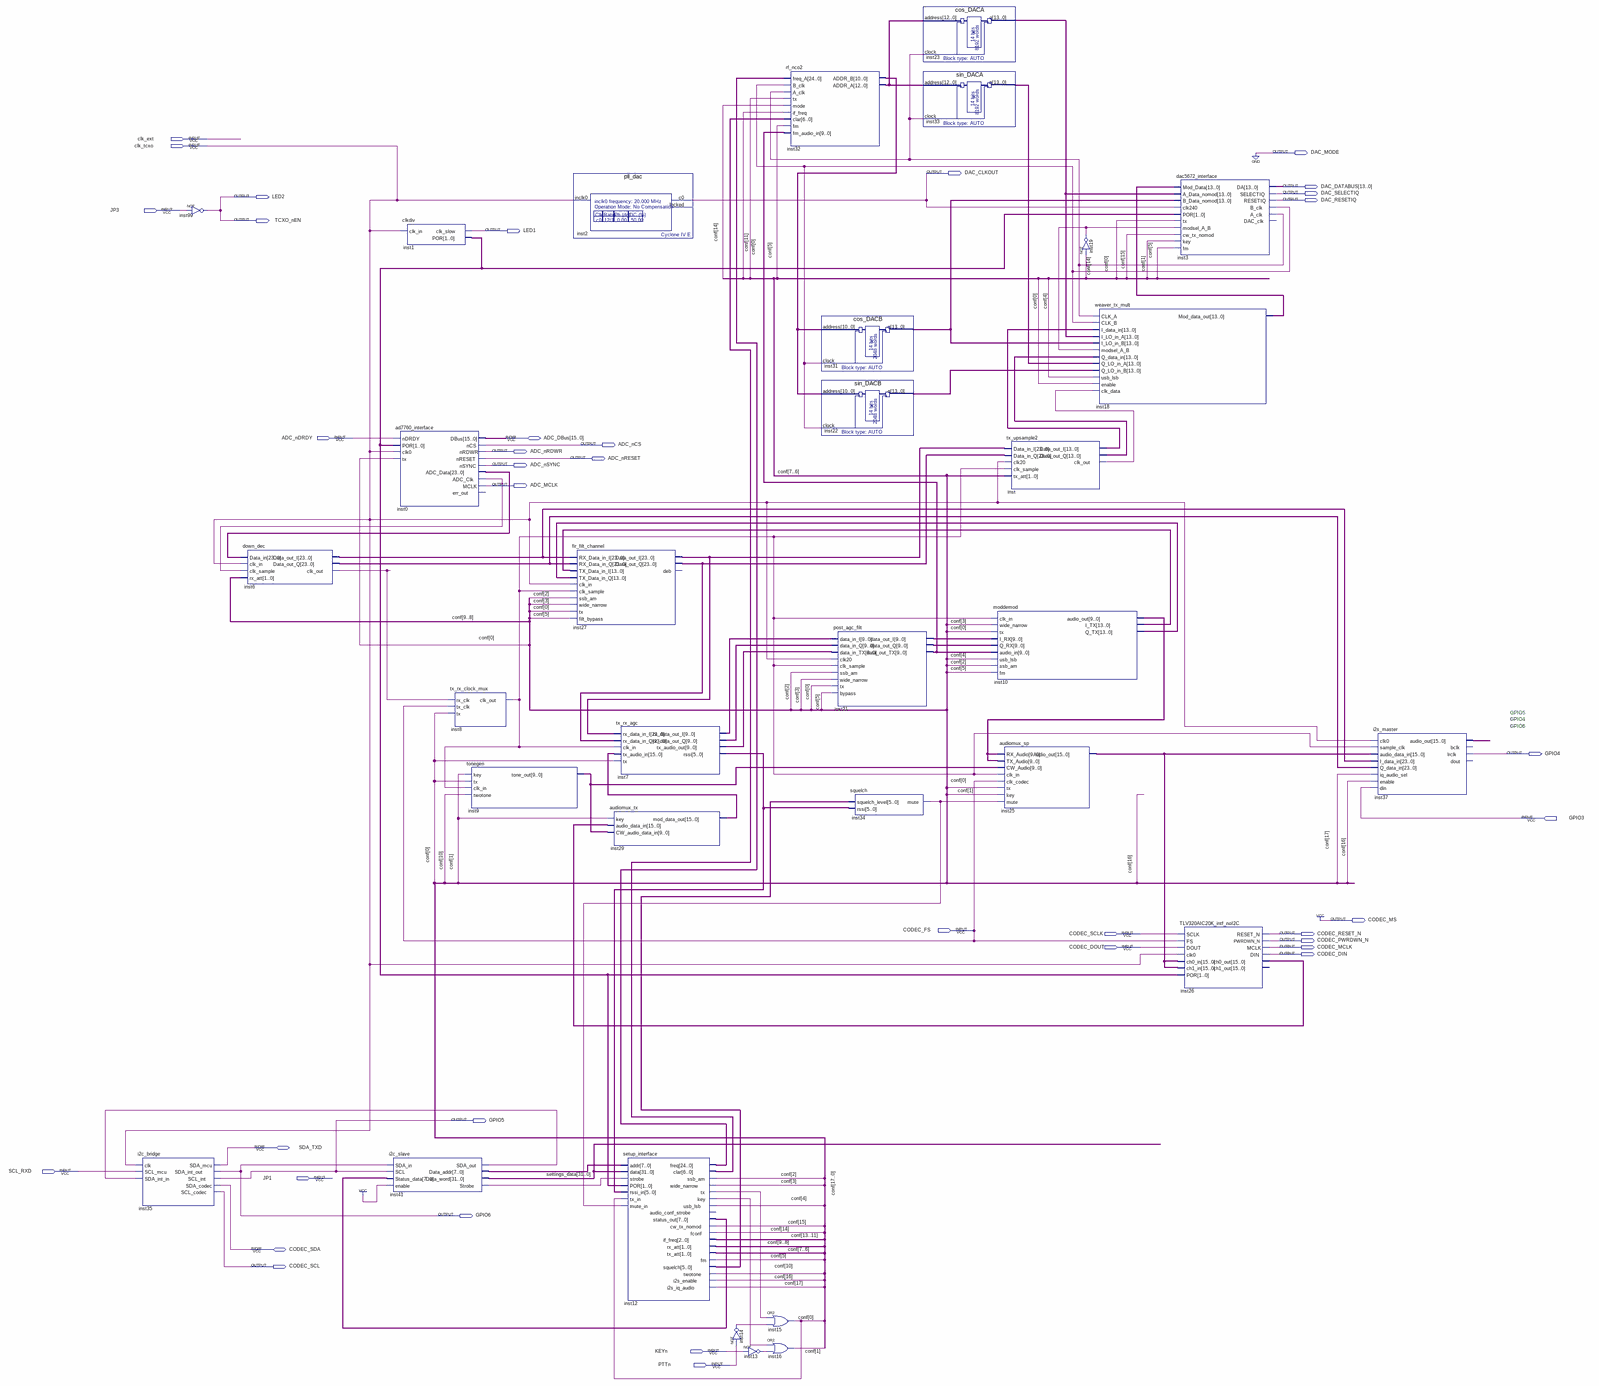
[diagram p0: schematic sheet, whole]
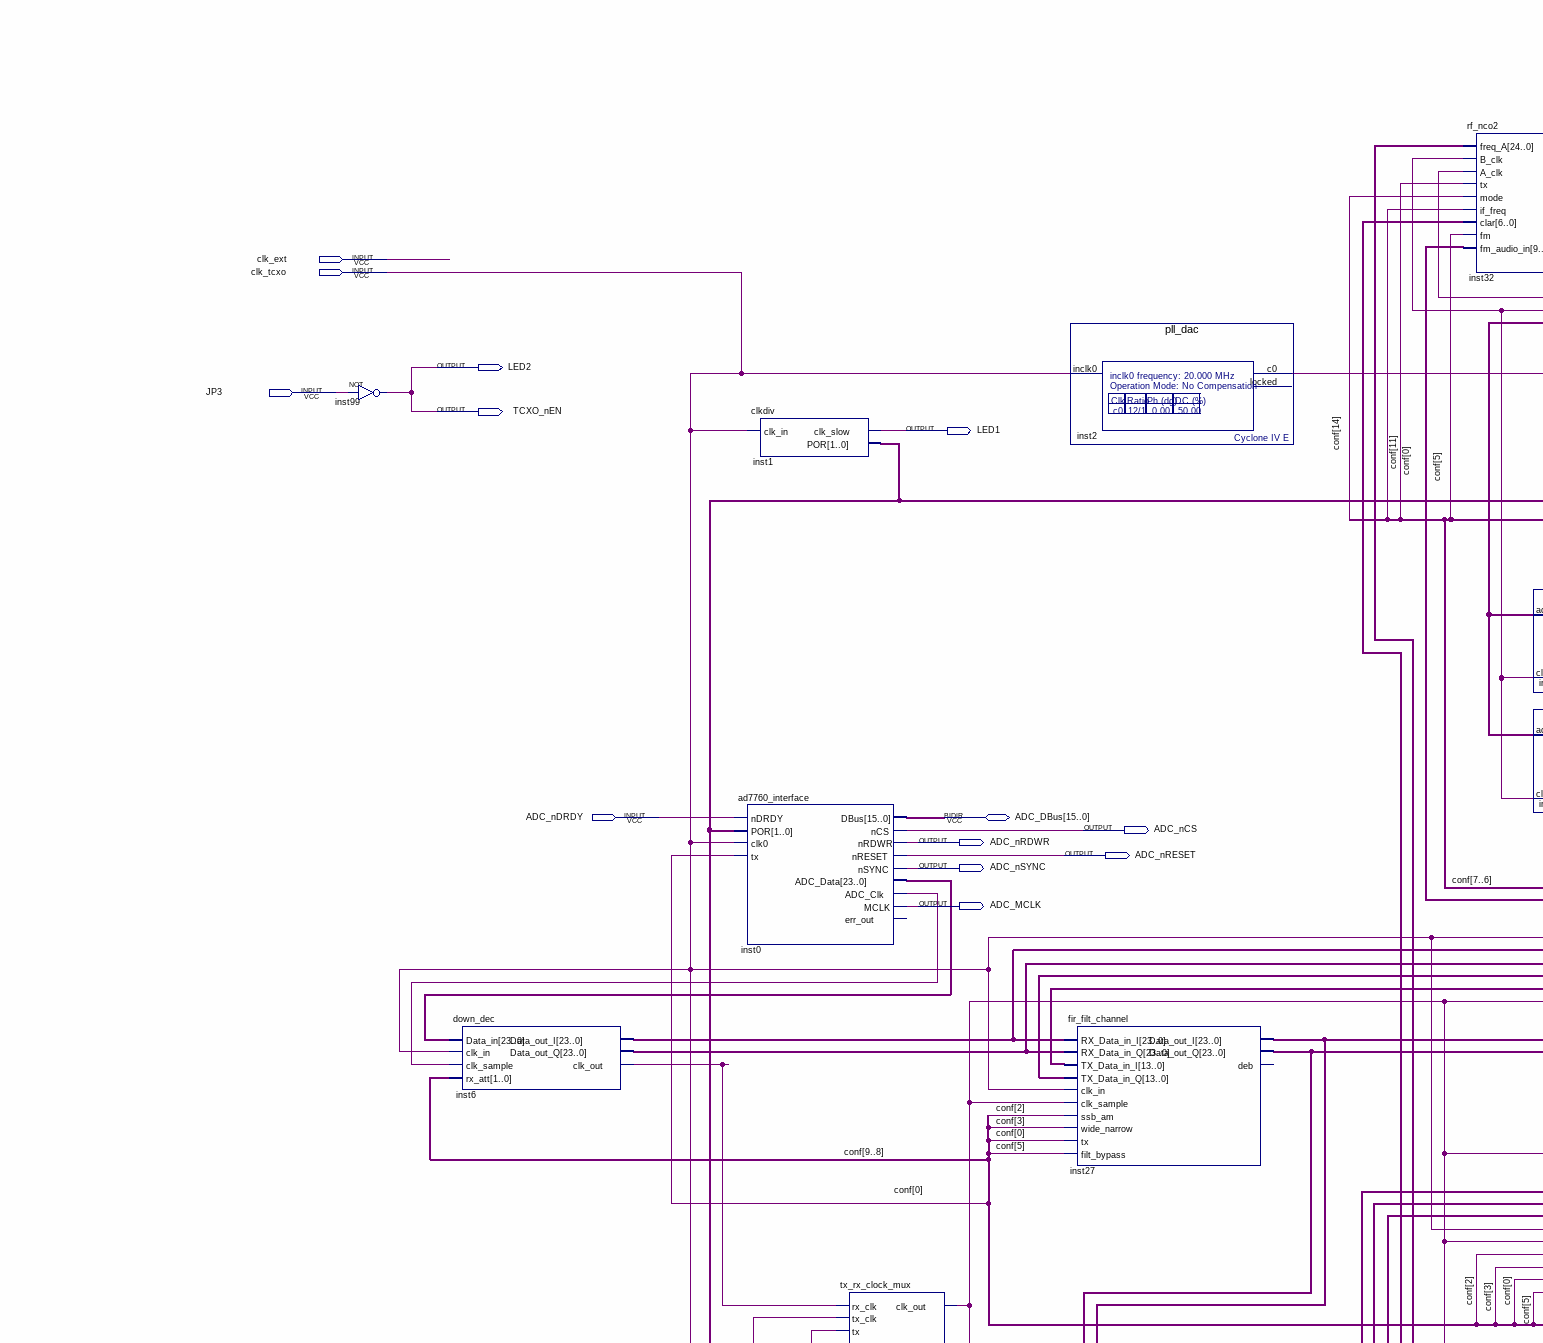
[diagram p1: schematic sheet, upper left part]
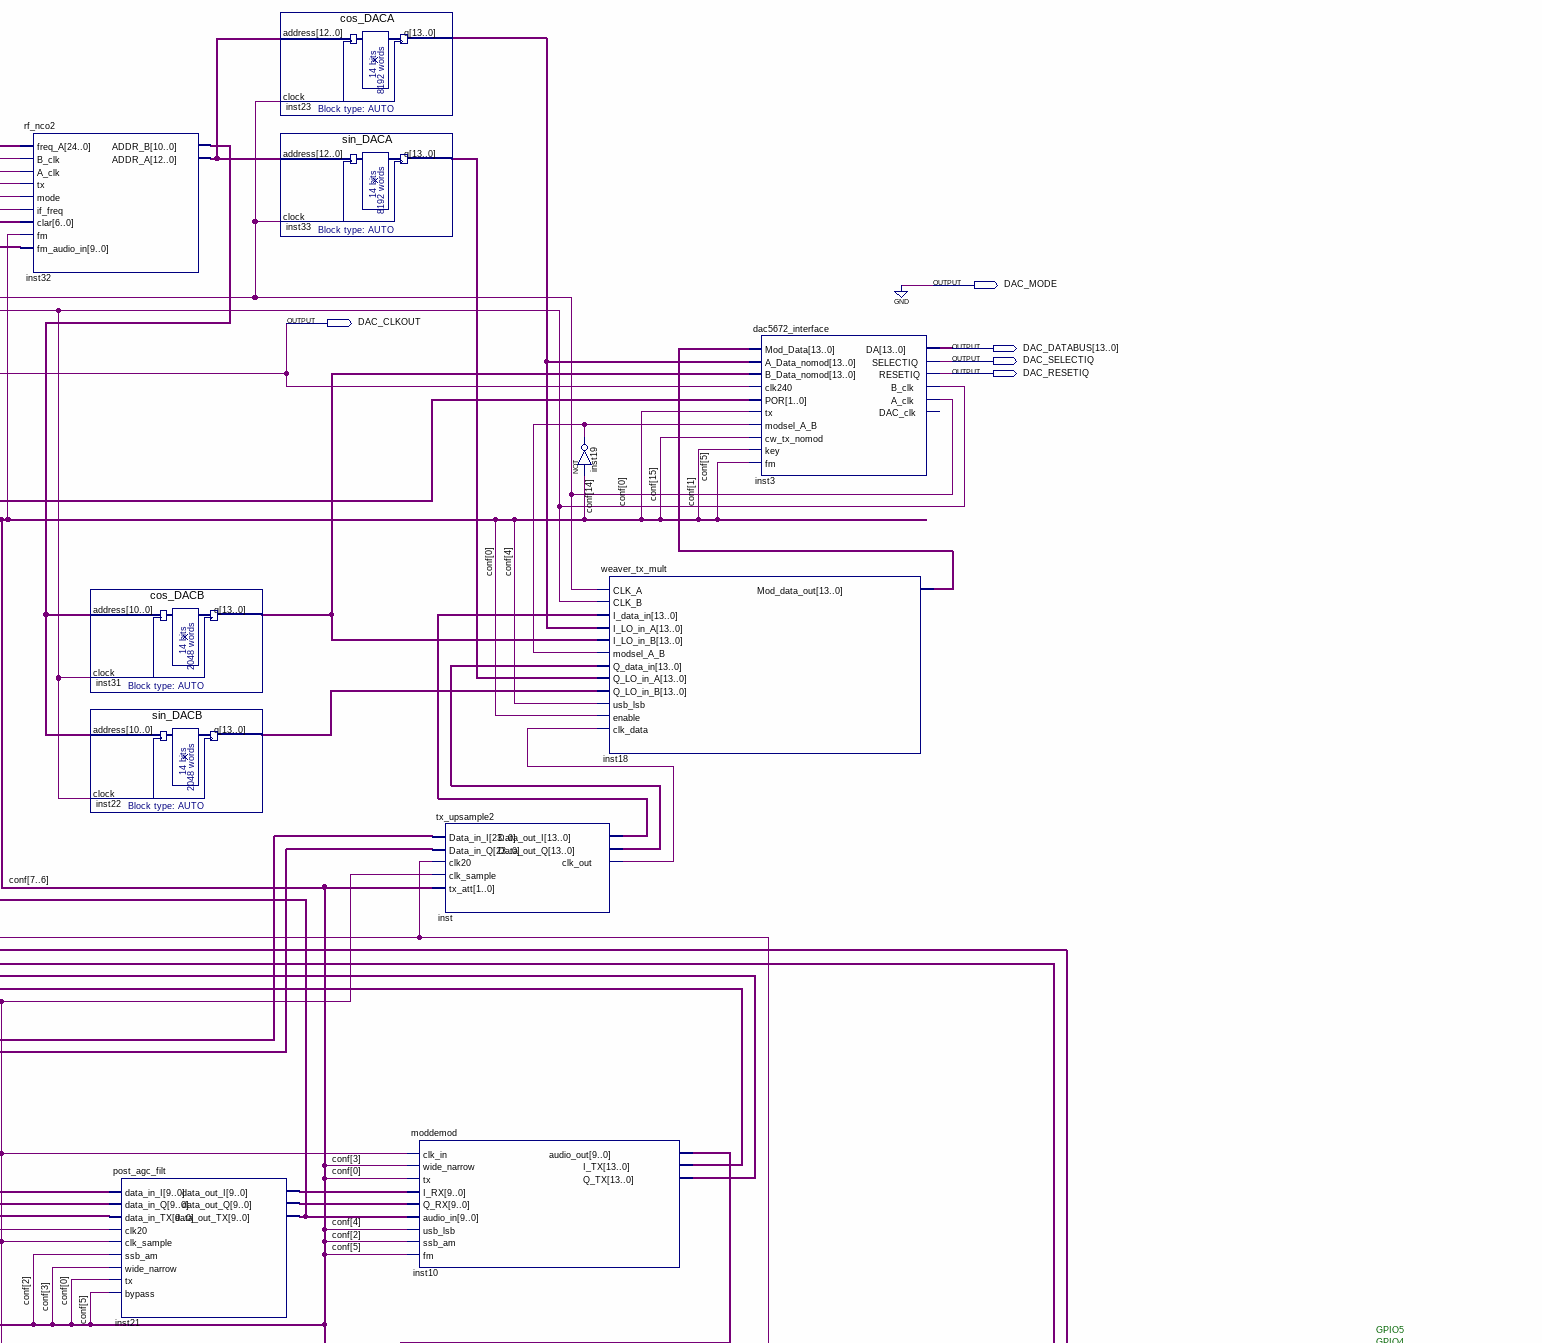
[diagram p2: schematic sheet, upper right part]
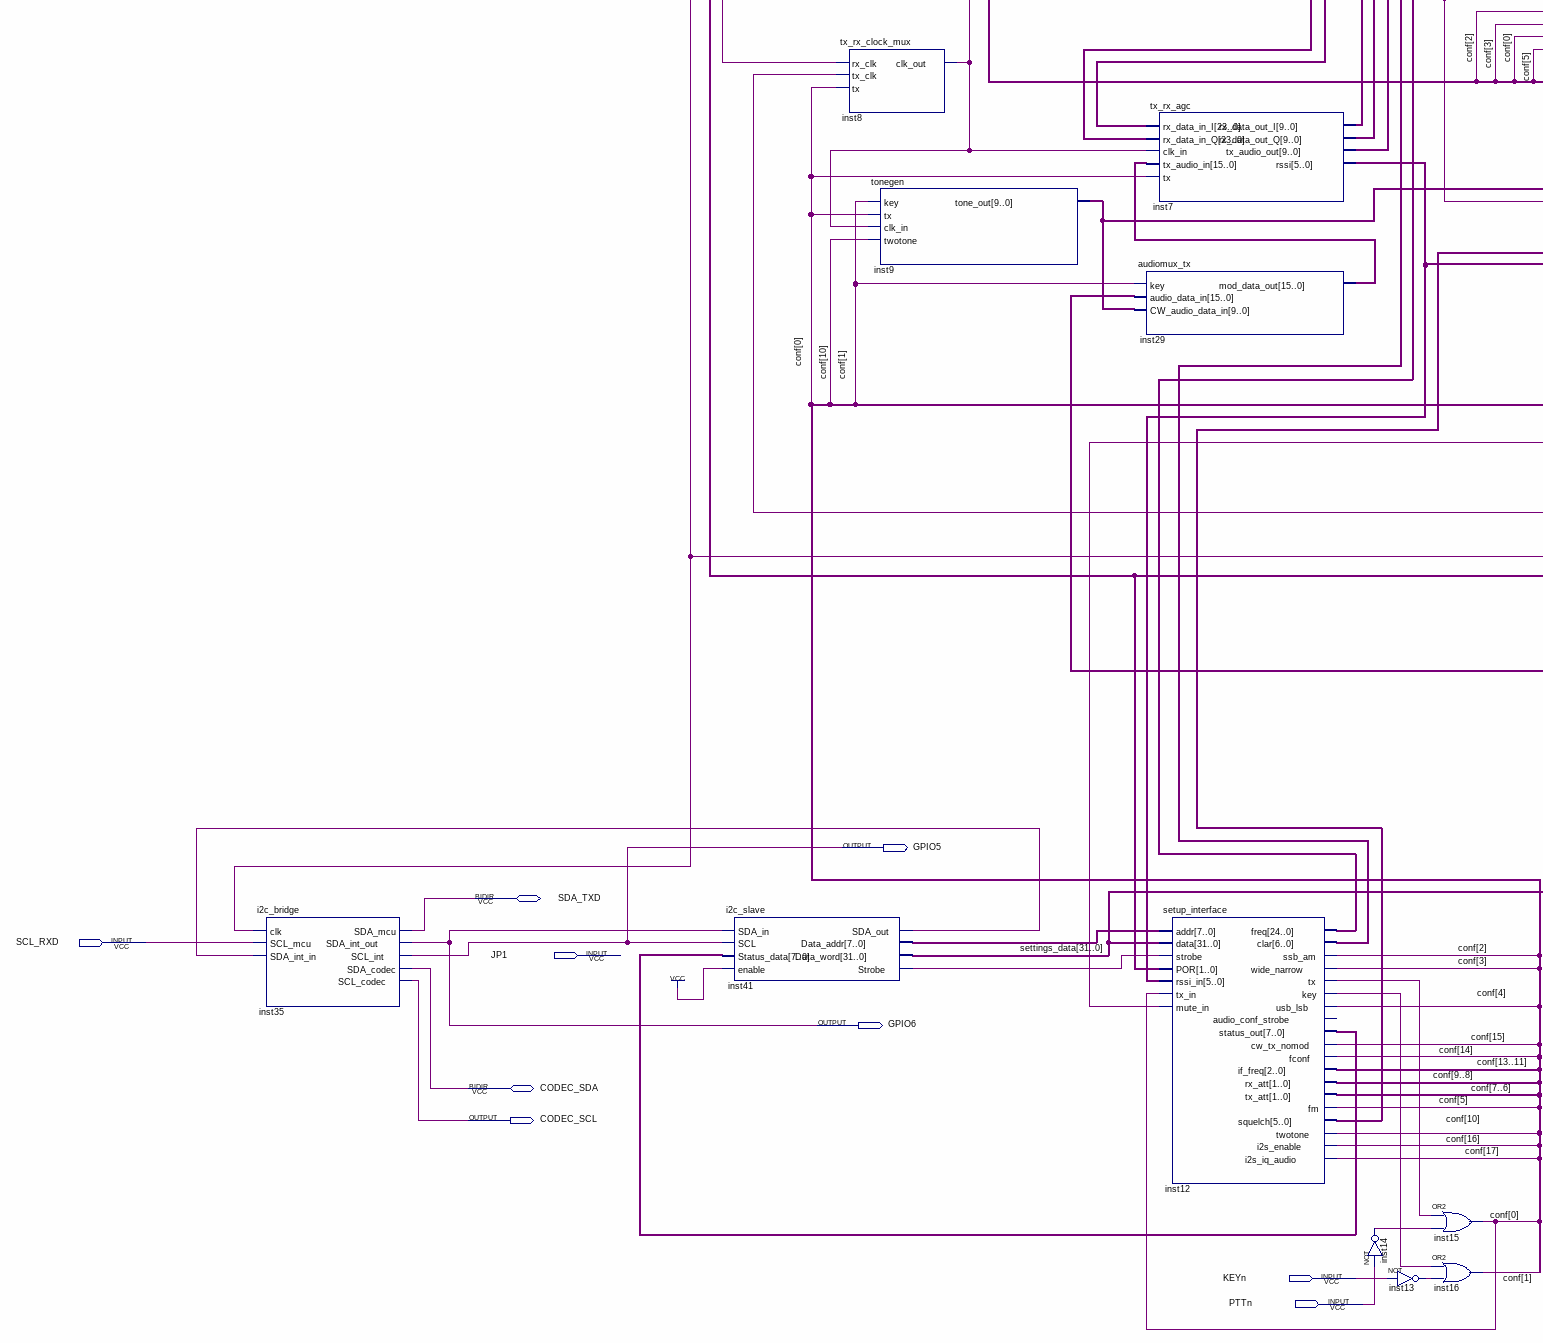
[diagram p3: schematic sheet, lower left part]
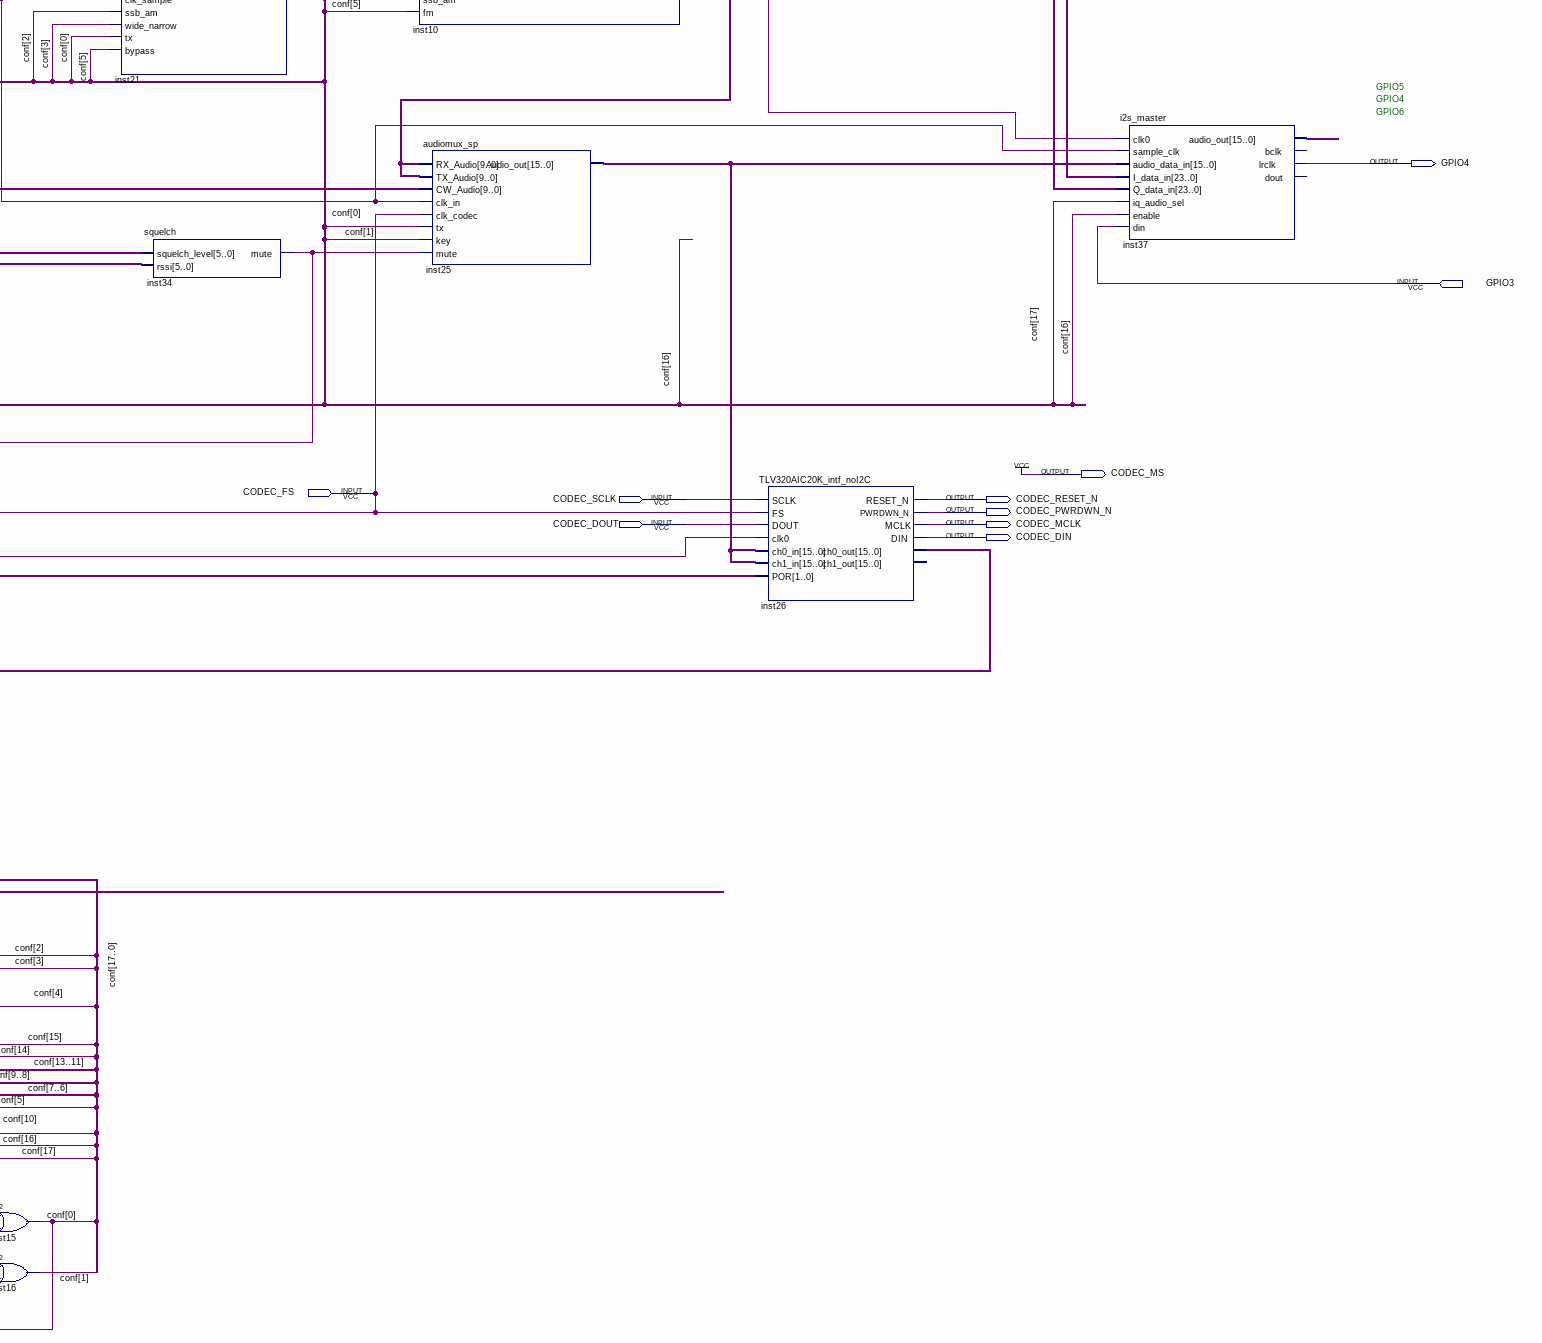
[diagram p4: schematic sheet, lower right part]
// Quartus schematic trx.bdf as structural Verilog: 32 symbols, 37 pins
module trx (
  input  clk_ext,
  input  clk_tcxo,
  input  JP3,
  input  ADC_nDRDY,
  input  GPIO3,
  input  CODEC_FS,
  input  CODEC_SCLK,
  input  CODEC_DOUT,
  input  SCL_RXD,
  input  JP1,
  input  KEYn,
  input  PTTn,
  inout  [15:0] ADC_DBus,
  inout  SDA_TXD,
  inout  CODEC_SDA,
  output DAC_MODE,
  output DAC_CLKOUT,
  output [13:0] DAC_DATABUS,
  output DAC_SELECTIQ,
  output LED2,
  output DAC_RESETIQ,
  output TCXO_nEN,
  output LED1,
  output ADC_nCS,
  output ADC_nRDWR,
  output ADC_nRESET,
  output ADC_nSYNC,
  output ADC_MCLK,
  output GPIO4,
  output CODEC_MS,
  output CODEC_RESET_N,
  output CODEC_PWRDWN_N,
  output CODEC_MCLK,
  output CODEC_DIN,
  output GPIO5,
  output GPIO6,
  output CODEC_SCL
);

  wire inst0_adc_clk, inst3_a_clk, inst3_b_clk, inst6_clk_out, inst8_clk_out, inst12_key, inst12_tx,
       inst13_out, inst14_out, inst19_out, inst34_mute, inst41_sda_out, inst41_strobe, inst_clk_out;
  wire [1:0] inst1_por;
  wire [5:0] inst7_rssi, inst12_squelch;
  wire [6:0] inst12_clar;
  wire [7:0] inst12_status_out, inst41_data_addr;
  wire [9:0] inst7_rx_data_out_i, inst7_rx_data_out_q, inst7_tx_audio_out, inst9_tone_out, inst10_audio_out,
       inst21_data_out_i, inst21_data_out_q, inst21_data_out_tx;
  wire [10:0] inst32_addr_b;
  wire [12:0] inst32_addr_a;
  wire [13:0] inst10_i_tx, inst10_q_tx, inst18_mod_data_out, inst22_q, inst23_q, inst31_q, inst33_q,
       inst_data_out_i, inst_data_out_q;
  wire [15:0] inst25_audio_out, inst26_ch0_out, inst29_mod_data_out, inst37_audio_out;
  wire [17:0] conf;
  wire [23:0] inst0_adc_data, inst6_data_out_i, inst6_data_out_q, inst27_data_out_i, inst27_data_out_q;
  wire [24:0] inst12_freq;
  wire [31:0] settings_data;

  i2c_bridge inst35 (
    .clk(clk_tcxo), .SCL_mcu(SCL_RXD), .SDA_int_in(inst41_sda_out), .SDA_int_out(GPIO6), .SCL_int(GPIO5),
    .SCL_codec(CODEC_SCL), .SDA_mcu(SDA_TXD), .SDA_codec(CODEC_SDA));
  not inst99 (LED2, JP3);
  down_dec inst6 (
    .Data_in(inst0_adc_data), .clk_in(clk_tcxo), .clk_sample(inst0_adc_clk), .rx_att(conf[9:8]),
    .Data_out_I(inst6_data_out_i), .Data_out_Q(inst6_data_out_q), .clk_out(inst6_clk_out));
  clkdiv inst1 (.clk_in(clk_tcxo), .clk_slow(LED1), .POR(inst1_por));
  ad7760_interface inst0 (
    .nDRDY(ADC_nDRDY), .POR(inst1_por), .clk0(clk_tcxo), .tx(conf[0]), .nCS(ADC_nCS), .nRDWR(ADC_nRDWR),
    .nRESET(ADC_nRESET), .nSYNC(ADC_nSYNC), .ADC_Data(inst0_adc_data), .ADC_Clk(inst0_adc_clk),
    .MCLK(ADC_MCLK), .DBus(ADC_DBus));  // open: err_out
  i2c_slave inst41 (
    .SDA_in(GPIO6), .SCL(GPIO5), .Status_data(inst12_status_out), .enable(1'b1), .SDA_out(inst41_sda_out),
    .Data_addr(inst41_data_addr), .Data_word(settings_data), .Strobe(inst41_strobe));
  tx_rx_clock_mux inst8 (.rx_clk(inst6_clk_out), .tx_clk(CODEC_FS), .tx(conf[0]), .clk_out(inst8_clk_out));
  tonegen inst9 (.key(conf[1]), .tx(conf[0]), .clk_in(inst8_clk_out), .twotone(conf[10]), .tone_out(inst9_tone_out));
  pll_dac inst2 (.inclk0(clk_tcxo), .c0(DAC_CLKOUT));  // open: locked
  fir_filt_channel inst27 (
    .RX_Data_in_I(inst6_data_out_i), .RX_Data_in_Q(inst6_data_out_q), .TX_Data_in_I(inst10_i_tx),
    .TX_Data_in_Q(inst10_q_tx), .clk_in(clk_tcxo), .clk_sample(inst8_clk_out), .ssb_am(conf[2]),
    .wide_narrow(conf[3]), .tx(conf[0]), .filt_bypass(conf[5]), .Data_out_I(inst27_data_out_i),
    .Data_out_Q(inst27_data_out_q));  // open: deb
  tx_rx_agc inst7 (
    .rx_data_in_I(inst27_data_out_i), .rx_data_in_Q(inst27_data_out_q), .clk_in(inst8_clk_out),
    .tx_audio_in(inst29_mod_data_out), .tx(conf[0]), .rx_data_out_I(inst7_rx_data_out_i),
    .rx_data_out_Q(inst7_rx_data_out_q), .tx_audio_out(inst7_tx_audio_out), .rssi(inst7_rssi));
  audiomux_tx inst29 (
    .key(conf[1]), .audio_data_in(inst26_ch0_out), .CW_audio_data_in(inst9_tone_out),
    .mod_data_out(inst29_mod_data_out));
  setup_interface inst12 (
    .addr(inst41_data_addr), .data(settings_data), .strobe(inst41_strobe), .POR(inst1_por),
    .rssi_in(inst7_rssi), .tx_in(conf[0]), .mute_in(inst34_mute), .freq(inst12_freq), .clar(inst12_clar),
    .ssb_am(conf[2]), .wide_narrow(conf[3]), .tx(inst12_tx), .key(inst12_key), .usb_lsb(conf[4]),
    .status_out(inst12_status_out), .cw_tx_nomod(conf[15]), .fconf(conf[14]), .if_freq(conf[13:11]),
    .rx_att(conf[9:8]), .tx_att(conf[7:6]), .fm(conf[5]), .squelch(inst12_squelch), .twotone(conf[10]),
    .i2s_enable(conf[16]), .i2s_iq_audio(conf[17]));  // open: audio_conf_strobe
  not inst14 (inst14_out, PTTn);
  not inst13 (inst13_out, KEYn);
  or inst15 (conf[0], inst12_tx, inst14_out);
  or inst16 (conf[1], inst12_key, inst13_out);
  rf_nco2 inst32 (
    .freq_A(inst12_freq), .B_clk(inst3_b_clk), .A_clk(inst3_a_clk), .tx(conf[0]), .mode(conf[14]),
    .if_freq(conf[11]), .clar(inst12_clar), .fm(conf[5]), .fm_audio_in(inst21_data_out_tx),
    .ADDR_B(inst32_addr_b), .ADDR_A(inst32_addr_a));
  cos_DACB inst31 (.address(inst32_addr_b), .clock(inst3_b_clk), .q(inst31_q));
  sin_DACB inst22 (.address(inst32_addr_b), .clock(inst3_b_clk), .q(inst22_q));
  post_agc_filt inst21 (
    .data_in_I(inst7_rx_data_out_i), .data_in_Q(inst7_rx_data_out_q), .data_in_TX(inst7_tx_audio_out),
    .clk20(clk_tcxo), .clk_sample(inst8_clk_out), .ssb_am(conf[2]), .wide_narrow(conf[3]), .tx(conf[0]),
    .bypass(conf[5]), .data_out_I(inst21_data_out_i), .data_out_Q(inst21_data_out_q),
    .data_out_TX(inst21_data_out_tx));
  squelch inst34 (.squelch_level(inst12_squelch), .rssi(inst7_rssi), .mute(inst34_mute));
  cos_DACA inst23 (.address(inst32_addr_a), .clock(inst3_a_clk), .q(inst23_q));
  sin_DACA inst33 (.address(inst32_addr_a), .clock(inst3_a_clk), .q(inst33_q));
  moddemod inst10 (
    .clk_in(inst8_clk_out), .wide_narrow(conf[3]), .tx(conf[0]), .I_RX(inst21_data_out_i),
    .Q_RX(inst21_data_out_q), .audio_in(inst21_data_out_tx), .usb_lsb(conf[4]), .ssb_am(conf[2]),
    .fm(conf[5]), .audio_out(inst10_audio_out), .I_TX(inst10_i_tx), .Q_TX(inst10_q_tx));
  audiomux_sp inst25 (
    .RX_Audio(inst10_audio_out), .TX_Audio(inst10_audio_out), .CW_Audio(inst9_tone_out),
    .clk_in(inst8_clk_out), .clk_codec(CODEC_FS), .tx(conf[0]), .key(conf[1]), .mute(inst34_mute),
    .Audio_out(inst25_audio_out));
  tx_upsample2 inst (
    .Data_in_I(inst27_data_out_i), .Data_in_Q(inst27_data_out_q), .clk20(clk_tcxo),
    .clk_sample(inst8_clk_out), .tx_att(conf), .Data_out_I(inst_data_out_i), .Data_out_Q(inst_data_out_q),
    .clk_out(inst_clk_out));
  not inst19 (inst19_out, conf[14]);
  weaver_tx_mult inst18 (
    .CLK_A(inst3_a_clk), .CLK_B(inst3_b_clk), .I_data_in(inst_data_out_i), .I_LO_in_A(inst23_q),
    .I_LO_in_B(inst31_q), .modsel_A_B(inst19_out), .Q_data_in(inst_data_out_q), .Q_LO_in_A(inst33_q),
    .Q_LO_in_B(inst22_q), .usb_lsb(conf[4]), .enable(conf[0]), .clk_data(inst_clk_out),
    .Mod_data_out(inst18_mod_data_out));
  dac5672_interface inst3 (
    .Mod_Data(inst18_mod_data_out), .A_Data_nomod(inst23_q), .B_Data_nomod(inst31_q), .clk240(DAC_CLKOUT),
    .POR(inst1_por), .tx(conf[0]), .modsel_A_B(inst19_out), .cw_tx_nomod(conf[15]), .key(conf[1]),
    .fm(conf[5]), .DA(DAC_DATABUS), .SELECTIQ(DAC_SELECTIQ), .RESETIQ(DAC_RESETIQ), .B_clk(inst3_b_clk),
    .A_clk(inst3_a_clk));  // open: DAC_clk
  TLV320AIC20K_intf_noI2C inst26 (
    .SCLK(CODEC_SCLK), .FS(CODEC_FS), .DOUT(CODEC_DOUT), .clk0(clk_tcxo), .ch0_in(inst25_audio_out),
    .ch1_in(inst25_audio_out), .POR(inst1_por), .RESET_N(CODEC_RESET_N), .PWRDWN_N(CODEC_PWRDWN_N),
    .MCLK(CODEC_MCLK), .DIN(CODEC_DIN), .ch0_out(inst26_ch0_out));  // open: ch1_out
  i2s_master inst37 (
    .clk0(clk_tcxo), .sample_clk(inst8_clk_out), .audio_data_in(inst25_audio_out),
    .I_data_in(inst6_data_out_i), .Q_data_in(inst6_data_out_q), .iq_audio_sel(conf[17]), .enable(conf[16]),
    .din(GPIO3), .audio_out(inst37_audio_out), .lrclk(GPIO4));  // open: bclk, dout

  assign CODEC_MS = 1'b1;
  assign DAC_MODE = 1'b0;
  assign TCXO_nEN = LED2;

  // Notes on the sheet:
  //   GPIO5
  //   GPIO4
  //   GPIO6
endmodule
